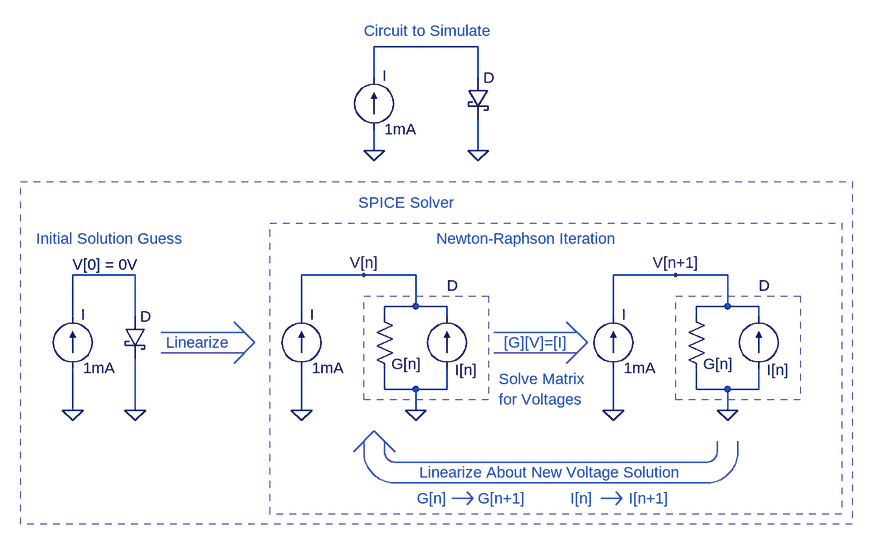
[diagram p0: schematic nr.asc]
nr.asc, the LTspice schematic file:
Version 4
SHEET 1 1332 848
WIRE -304 192 -304 128
WIRE -304 336 -304 272
WIRE -208 128 -304 128
WIRE -208 192 -208 128
WIRE -208 336 -208 256
WIRE 48 192 48 128
WIRE 48 336 48 272
WIRE 144 128 48 128
WIRE 160 -176 160 -224
WIRE 160 -64 160 -96
WIRE 176 192 176 176
WIRE 176 304 176 272
WIRE 224 128 144 128
WIRE 224 176 176 176
WIRE 224 176 224 128
WIRE 224 304 176 304
WIRE 224 336 224 304
WIRE 272 176 224 176
WIRE 272 192 272 176
WIRE 272 304 224 304
WIRE 272 304 272 272
WIRE 320 -224 160 -224
WIRE 320 -176 320 -224
WIRE 320 -64 320 -112
WIRE 528 192 528 128
WIRE 528 336 528 272
WIRE 624 128 528 128
WIRE 656 192 656 176
WIRE 656 304 656 272
WIRE 704 128 624 128
WIRE 704 176 656 176
WIRE 704 176 704 128
WIRE 704 304 656 304
WIRE 704 336 704 304
WIRE 752 176 704 176
WIRE 752 192 752 176
WIRE 752 304 704 304
WIRE 752 304 752 272
FLAG -208 336 0
FLAG -304 336 0
FLAG 224 336 0
FLAG 48 336 0
FLAG 144 128 V[n]
FLAG 704 336 0
FLAG 528 336 0
FLAG 624 128 V[n+1]
FLAG 320 -64 0
FLAG 160 -64 0
SYMBOL current -304 272 M180
WINDOW 0 13 83 Left 0
WINDOW 3 16 1 Left 0
SYMATTR InstName I
SYMATTR Value 1mA
SYMBOL schottky -224 192 R0
WINDOW 3 22 82 Left 0
SYMATTR Value ""
SYMATTR InstName D
SYMATTR Description Diode
SYMATTR Type diode
SYMBOL current 48 272 M180
WINDOW 0 13 83 Left 0
WINDOW 3 16 1 Left 0
SYMATTR InstName I
SYMATTR Value 1mA
SYMBOL res 160 176 R0
WINDOW 0 27 89 Left 0
SYMATTR InstName G[n]
SYMATTR Value ""
SYMBOL current 272 272 M180
WINDOW 3 24 0 Left 0
WINDOW 0 12 -2 Left 0
SYMATTR Value ""
SYMATTR InstName I[n]
SYMBOL current 528 272 M180
WINDOW 0 13 83 Left 0
WINDOW 3 16 1 Left 0
SYMATTR InstName I
SYMATTR Value 1mA
SYMBOL res 640 176 R0
WINDOW 0 27 89 Left 0
SYMATTR InstName G[n]
SYMATTR Value ""
SYMBOL current 752 272 M180
WINDOW 3 24 0 Left 0
WINDOW 0 12 -2 Left 0
SYMATTR Value ""
SYMATTR InstName I[n]
SYMBOL current 160 -96 M180
WINDOW 0 13 83 Left 0
WINDOW 3 16 1 Left 0
SYMATTR InstName I
SYMATTR Value 1mA
SYMBOL schottky 304 -176 R0
WINDOW 3 22 82 Left 0
SYMATTR Value ""
SYMATTR InstName D
SYMATTR Description Diode
SYMATTR Type diode
TEXT 272 144 Left 0 !D
TEXT 360 232 Left 0 ;[G][V]=[I]
TEXT -160 232 Left 0 ;Linearize
TEXT 432 432 Center 0 ;Linearize About New Voltage Solution
TEXT 256 72 Left 0 ;Newton-Raphson Iteration
TEXT 752 144 Left 0 !D
TEXT 352 288 Left 0 ;Solve Matrix\nfor Voltages
TEXT -360 72 Left 0 ;Initial Solution Guess
TEXT 144 -248 Left 0 ;Circuit to Simulate
TEXT 136 16 Left 0 ;SPICE Solver
TEXT 272 472 Right 0 ;G[n]
TEXT -304 112 Left 0 !V[0] = 0V
TEXT 552 472 Left 0 ;I[n+1]
TEXT 320 472 Left 0 ;G[n+1]
TEXT 496 472 Right 0 ;I[n]
LINE Normal 472 216 344 216
LINE Normal 488 232 456 200
LINE Normal 472 248 344 248
LINE Normal 488 232 456 264
LINE Normal -40 216 -168 216
LINE Normal -24 232 -56 200
LINE Normal -40 248 -168 248
LINE Normal -24 232 -56 264
LINE Normal 312 472 280 472
LINE Normal 312 472 303 462
LINE Normal 312 472 303 482
LINE Normal 541 472 509 472
LINE Normal 541 472 532 462
LINE Normal 541 472 532 482
LINE Normal 672 448 192 448
LINE Normal 672 416 192 416
LINE Normal 176 400 176 384
LINE Normal 144 400 144 384
LINE Normal 192 400 160 368
LINE Normal 128 400 160 368
LINE Normal 688 400 688 384
LINE Normal 720 400 720 384
RECTANGLE Normal 336 320 144 160 2
RECTANGLE Normal 816 320 624 160 2
RECTANGLE Normal 880 496 0 48 1
RECTANGLE Normal 896 512 -384 -16 1
ARC Normal 144 352 240 448 143 399 192 447
ARC Normal 176 384 208 416 176 400 191 415
ARC Normal 720 352 624 448 672 447 721 399
ARC Normal 688 384 656 416 673 415 688 400

The netlist it stands for:
* nr.asc
I 0 N001 1mA
D N001 0
I 0 V[n] 1mA
R§G[n] V[n] 0
I[n] 0 V[n]
I 0 V[n+1] 1mA
R§G[n] V[n+1] 0
I[n] 0 V[n+1]
I 0 N002 1mA
D N002 0
.model D D
.lib standard.dio
D
* [G][V]=[I]
* Linearize
* Linearize About New Voltage Solution
* Newton-Raphson Iteration
D
* Solve Matrix
* for Voltages
* Initial Solution Guess
* Circuit to Simulate
* SPICE Solver
* G[n]
V[0] = 0V
* I[n+1]
* G[n+1]
* I[n]
.backanno
.end